# Altium schematic sheet 5V_ISOLATED_SUPPLY.SchDoc
size A4; SheetNumber: 6; SheetTotal: 16
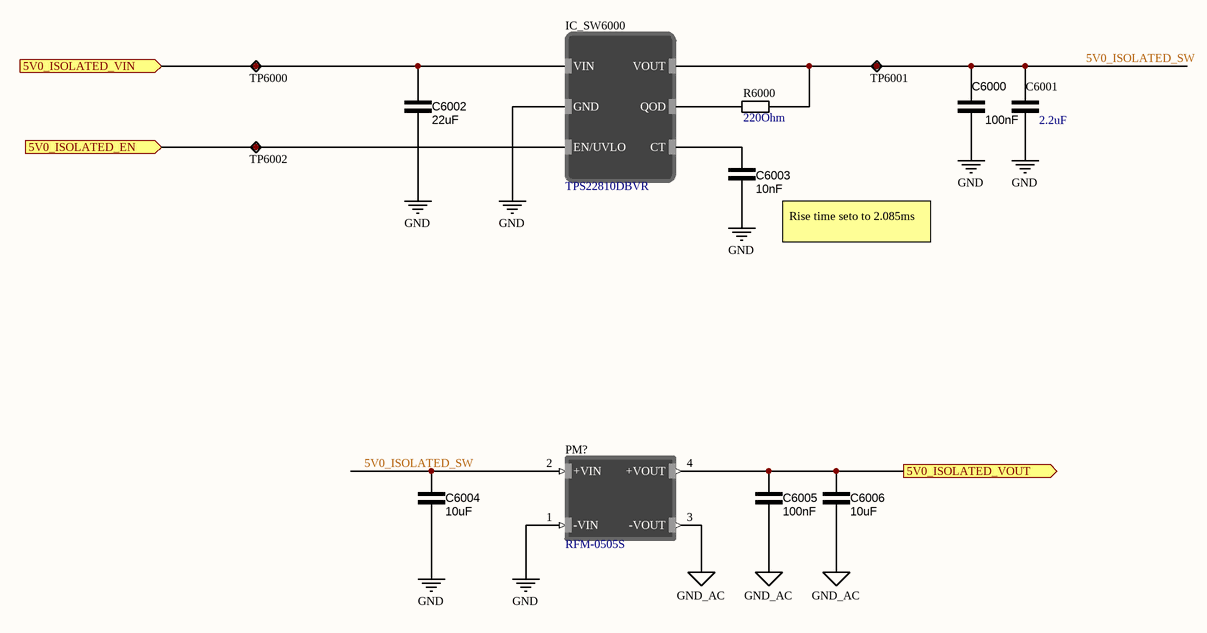
[diagram p0: 5V_ISOLATED_SUPPLY.SchDoc]

## Parts
C6000  100nF  [CAP_0603]
C6001  2.2uF  [CAP_0603]
C6002  22uF  [CAP_0805]
C6003  10nF  [CAP_0603]
C6004  10uF  [CAP_0805]
C6005  100nF  [CAP_0603]
C6006  10uF  [CAP_0805]
IC_SW6000  TPS22810DBVR  [SOT95P280X145-6N]
PM?  RFM-0505S  [CONV_RFM-0505S]
R6000  220Ohm  [RES_0603]
TP6000  Test point  [TestPoint]  (value not drawn)
TP6001  Test point  [TestPoint]  (value not drawn)
TP6002  Test point  [TestPoint]  (value not drawn)

## Ports
5V0_ISOLATED_EN (in, see POWER_DELIVERY_AND_MONITORING[2C]), 5V0_ISOLATED_VIN (in, see POWER_DELIVERY_AND_MONITORING[2C]), 5V0_ISOLATED_VOUT (out, see POWER_DELIVERY_AND_MONITORING[2C])

## Nets
GND: C6000.2 C6001.1 C6002.1 C6003.1 C6004.1 IC_SW6000.2(GND) PM?.1(-VIN)
GND_AC: C6005.1 C6006.1 PM?.3(-VOUT)
5V0_ISOLATED_EN: IC_SW6000.3(EN/UVLO) TP6002.1 ; port 5V0_ISOLATED_EN
5V0_ISOLATED_SW: C6000.1 C6001.2 C6004.2 IC_SW6000.6(VOUT) PM?.2(+VIN) R6000.2 TP6001.1
5V0_ISOLATED_VIN: C6002.2 IC_SW6000.1(VIN) TP6000.1 ; port 5V0_ISOLATED_VIN
5V0_ISOLATED_VOUT: C6005.2 C6006.2 PM?.4(+VOUT) ; port 5V0_ISOLATED_VOUT
NetC6003_2: C6003.2 IC_SW6000.4(CT)
NetIC_SW6000_5: IC_SW6000.5(QOD) R6000.1

## Notes on the sheet
- (near C6003) Rise time seto to 2.085ms

## Library data of the parts
C6000 = C000007: 0.1 µF ±10% 25V Ceramic Capacitor X7R 0603 (1608 Metric); ComponentLink1Description: DigiKey; ComponentLink1URL: https://www.digikey.com/en/products/detail/kyocera-avx/06033C104K4T2A/8019250; DigiKey Part Number: 478-KAM15AR71E104KTCT-ND; capacitance: 100nF
C6001 = C000014: 8 pF ±0.05pF 25V Ceramic Capacitor C0G, NP0 01005 (0402 Metric); ComponentLink1Description: DigiKey; ComponentLink1URL: https://www.digikey.com/en/products/detail/murata-electronics/GRM188C71C225KE11D/4905311; DigiKey Part Number: 490-12731-1-ND; capacitance: 2.2uF
C6002 = C000001: 22 µF ±20% 25V Ceramic Capacitor X5R 0805 (2012 Metric); ComponentLink1Description: DigiKey; ComponentLink1URL: https://www.digikey.com/en/products/detail/tdk-corporation/C2012X5R1E226M125AC/3661564; DigiKey Part Number: 445-9112-1-ND; capacitance: 22uF
C6003 = C000005: 10000 pF ±20% 25V Ceramic Capacitor X7R 0603 (1608 Metric); ComponentLink1Description: DigiKey; ComponentLink1URL: https://www.digikey.com/en/products/detail/kyocera-avx/06033C103MAT2A/1599370; DigiKey Part Number: 478-KGM15AR71E103MTCT-ND; capacitance: 10nF
C6004 C6006 = C000002: 10 µF ±10% 25V Ceramic Capacitor X5R 0805 (2012 Metric); Manufacturer Product Number: C2012X5R1E106K125AB; capacitance: 10uF; ComponentLink1Description: DigiKey; ComponentLink1URL: https://www.digikey.com/en/products/detail/tdk-corporation/C2012X5R1E106K125AB/2443462; DigiKey Part Number: 445-5984-1-ND
C6005 = C000007: 0.1 µF ±10% 25V Ceramic Capacitor X7R 0603 (1608 Metric); Manufacturer Product Number: KAM15AR71E104KT; capacitance: 100nF; ComponentLink1Description: DigiKey; ComponentLink1URL: https://www.digikey.com/en/products/detail/kyocera-avx/06033C104K4T2A/8019250; DigiKey Part Number: 478-KAM15AR71E104KTCT-ND
IC_SW6000 = TPS22810: Power Switch/Driver 1:1 N-Channel 2A SOT-23-6; DigiKey Part Number: 296-45297-1-ND; Mouser Part Number: 595-TPS22810DBVR; ComponentLink1Description: DigiKey; ComponentLink1URL: https://www.digikey.com/en/products/detail/texas-instruments/TPS22810DBVR/6595640; ComponentLink2Description: Mouser; ComponentLink2URL: https://eu.mouser.com/ProductDetail/Texas-Instruments/TPS22810DBVR?qs=34RfhUjJmKcFqeJVMZZhPA%3D%3D
PM? = RFM-0505S: Isolated Module DC DC Converter 1 Output 5V 200mA - 5V Input; DigiKey Part Number: 945-3159-ND; Mouser Part Number: 919-RFM-0505S; Manufacturer Product Number: RFM-0505S; JLCPCB Part Number: C22371855; ComponentLink1Description: DigiKey; ComponentLink1URL: https://www.digikey.com/en/products/detail/recom-power/RFM-0505S/8550767; ComponentLink2Description: Mouser; ComponentLink2URL: https://eu.mouser.com/ProductDetail/RECOM-Power/RFM-0505S?qs=lYGu3FyN48dRVYKTH5ipqg%3D%3D
R6000 = R000021: 220 Ohms ±5% 0.1W, 1/10W Chip Resistor 0603 (1608 Metric) Automotive AEC-Q200 Thick Film; ComponentLink1Description: DigiKey; ComponentLink1URL: https://www.digikey.com/en/products/detail/panasonic-electronic-components/ERJ-3GEYJ221V/135719; resistance: 220Ohm; DigiKey Part Number: P220GCT-ND
TP6000-TP6002 = TP002: Test point 1mm